# Altium schematic sheet ADC_SIGNAL.SchDoc
size A
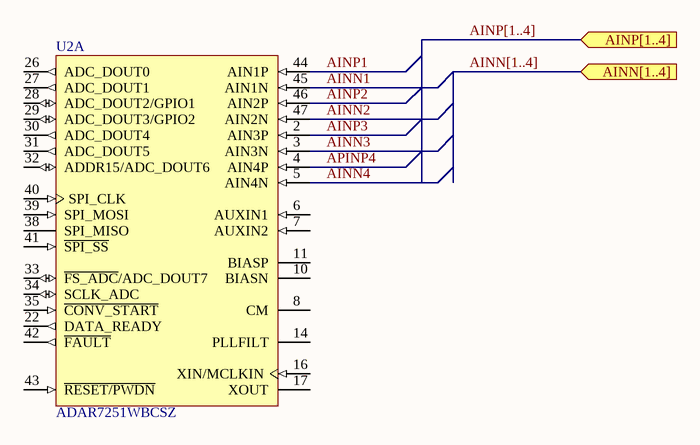
[diagram p0: ADC_SIGNAL.SchDoc]

## Parts
U2  ADAR7251WBCSZ  [ADI-CS-48-1_L]  (part A of 2)

## Ports
AINN[1..4] (in), AINP[1..4] (in)

## Nets
AINN1: U2.45(AIN1N)
AINN2: U2.47(AIN2N)
AINN3: U2.3(AIN3N)
AINN4: U2.5(AIN4N)
AINP1: U2.44(AIN1P)
AINP2: U2.46(AIN2P)
AINP3: U2.2(AIN3P)
APINP4: U2.4(AIN4P)

Not connected (* = marked no-connect by the designer): U2 6(AUXIN1) 7(AUXIN2) 8(CM) 10(BIASN) 11(BIASP) 14(PLLFILT) 16(XIN/MCLKIN) 17(XOUT) 22(DATA_READY) 26(ADC_DOUT0) 27(ADC_DOUT1) 28(ADC_DOUT2/GPIO1) 29(ADC_DOUT3/GPIO2) 30(ADC_DOUT4) 31(ADC_DOUT5) 32(ADDR15/ADC_DOUT6) 33(~{FS_ADC}/ADC_DOUT7) 34(SCLK_ADC) 35(~{CONV_START}) 38(SPI_MISO) 39(SPI_MOSI) 40(SPI_CLK) 41(~{SPI_SS}) 42(~{FAULT}) 43(~{RESET/PWDN})

## Buses and harness runs
bus AINN[1..4] = port AINN[1..4]
bus AINP[1..4] = port AINP[1..4]

## Library data of the parts
U2 = CMP-0313-02423-1: Continuous Time Data Acquisition ADC, 4-Channel, 16-Bit, -40 to 125 degC, 48-Pin QFN (CS-48-1), RoHS, Tray; DVDD Max: 1.98 V; Channel: 4; Sample Rate Max: 1.8 MSPS; DVDD Min: 1.62 V; AVDD Min: 2.97 V; AVDD Max: 3.6 V; PartNumber: ADAR7251WBCSZ; Mounting Technology: Surface Mount; ComponentLink1Description: Manufacturer URL; PackageVersion: 01/2014; Number of A/D Converters: 4; Temperature Min: -40 degC; Packing: Tray; ComponentLink3URL: http://www.analog.com/media/en/package-pcb-resources/package/pkg_pdf/lfcsp-cs-side-solderable/cs-48/CS_48_1.pdf; ComponentLink3Description: Package Specification; DatasheetVersion: Rev. 0; ComponentLink1URL: http://www.analog.com/en/index.html; ComponentLink2Description: Datasheet; Temperature Max: 125 degC; PackageDescription: 48-Pin Frame Chip Scale Package, Body 7 x 7 mm, Pitch 0.5 mm; RoHS: TRUE; ComponentLink2URL: http://www.analog.com/media/en/technical-documentation/data-sheets/ADAR7251.pdf